# Altium schematic sheet NBT_FREQ_CNT.SCHDOC
size A4; Organization: Altium Limited; Address1: L3, 12a Rodborough Rd; Address2: Frenchs Forest; Address3: NSW; Address4: Australia 2086; DocumentNumber: 7; SheetNumber: 7; SheetTotal: 12
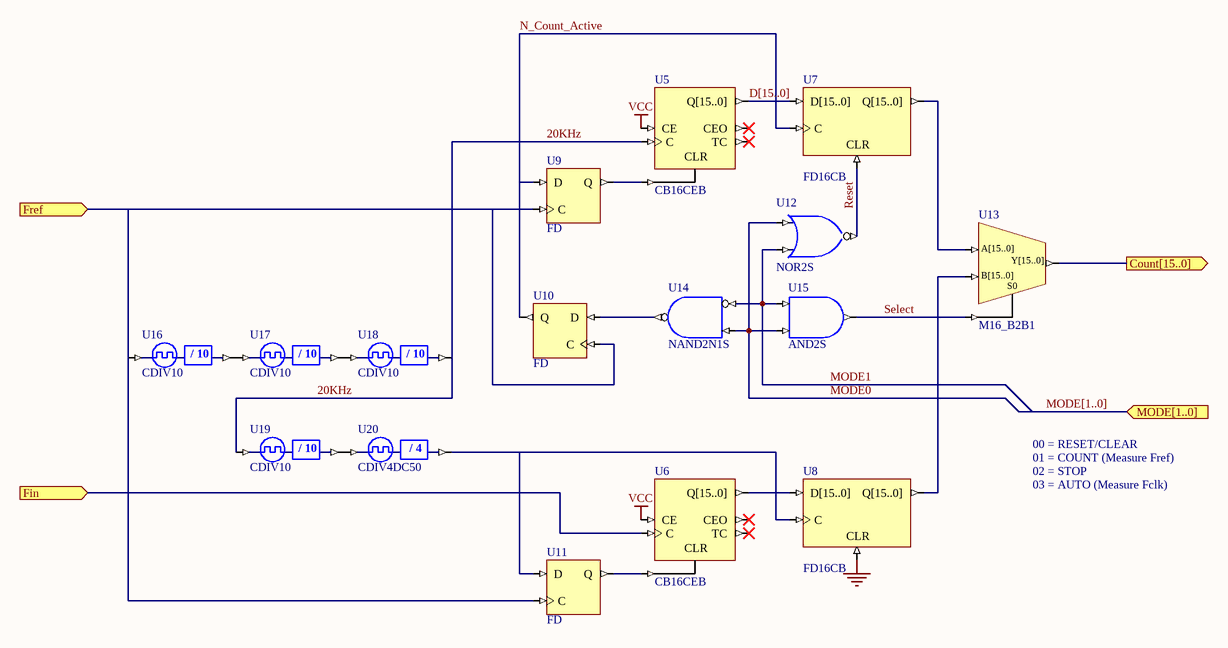
[diagram p0: NBT_FREQ_CNT.SCHDOC]

## Parts
U5  CB16CEB
U6  CB16CEB
U7  FD16CB
U8  FD16CB
U9  FD
U10  FD
U11  FD
U12  NOR2S
U13  M16_B2B1
U14  NAND2N1S
U15  AND2S
U16  CDIV10
U17  CDIV10
U18  CDIV10
U19  CDIV10
U20  CDIV4DC50

## Ports
Count[15..0] (out), Fin (in), Fref (in), MODE[1..0] (in)

## Nets
GND: U8.CLR
VCC: U5.CE U6.CE
20KHz: U5.C U18.CLKDV U19.CLKIN
Count[15..0]: U13.Y[15..0] ; port Count[15..0]
D[15..0]: U5.Q[15..0] U7.D[15..0]
Fin: U6.C ; port Fin
Fref: U9.C U10.C U11.C U16.CLKIN ; port Fref
MODE0: U12.I0 U14.I1 U15.I1
MODE1: U12.I1 U14.I0 U15.I0
N_Count_Active: U7.C U9.D U10.Q
Reset: U7.CLR U12.O
Select: U13.S0 U15.O
NetU5_CLR: U5.CLR U9.Q
NetU6_CLR: U6.CLR U11.Q
NetU6_Q[15..0]: U6.Q[15..0] U8.D[15..0]
NetU7_Q[15..0]: U7.Q[15..0] U13.A[15..0]
NetU8_C: U8.C U11.D U20.CLKDV
NetU8_Q[15..0]: U8.Q[15..0] U13.B[15..0]
NetU10_D: U10.D U14.O
NetU16_CLKDV: U16.CLKDV U17.CLKIN
NetU17_CLKDV: U17.CLKDV U18.CLKIN
NetU19_CLKDV: U19.CLKDV U20.CLKIN

Not connected (* = marked no-connect by the designer): U5 CEO* TC*; U6 CEO* TC*

## Buses and harness runs
bus D[15..0]
bus MODE[1..0] = port MODE[1..0]

## Notes on the sheet
- 00 = RESET/CLEAR
- 01 = COUNT (Measure Fref)
- 02 = STOP
- 03 = AUTO (Measure Fclk)
- Title
- Size:
- Date:
- A4
- Number:
- Time:
- Revision:
- Sheet
- of
- File:
- (in symbol CDIV4DC50) / 4
- (in symbol CDIV10) / 10

## Library data of the parts
U5 U6 = CB16CEB: 16-Bit Cascadable Binary Counters with Clock Enable and Asynchronous Clear, Bus Version; Xilinx Equivalent: CB16CE; ArchiveName: GENERIC; Published: 7-Nov-2003; Publisher: Altium Limited; Core Revision: 1.00.00
U7 U8 = FD16CB: 16-Bit D-Type Flip-Flop with Asynchronous Clear, Bus Version; ArchiveName: GENERIC; Published: 18-Dec-2003; Publisher: Altium Limited; Core Revision: 1.00.00
U9 U11 = FD: D-Type Flip-Flop; ArchiveName: GENERIC; Published: 18-Dec-2003; Publisher: Altium Limited; Xilinx Equivalent: FD; Core Revision: 1.00.00
U10 = FD: D-Type Flip-Flop; ArchiveName: GENERIC; VHDLIB_SIM: GENERIC_LIB; Published: 29-Jan-2004; Publisher: Altium Limited; Xilinx Equivalent: FD; Core Revision: 1.00.00
U12 = NOR2S: 2-Input NOR Gate, Single Pin Version; Xilinx Equivalent: NOR2; ArchiveName: GENERIC; VHDLIB_SIM: GENERIC_LIB; Published: 29-Jan-2004; Publisher: Altium Limited; Core Revision: 1.00.00
U13 = M16_B2B1: 2x16-Bit Bus to 1x16-Bit Bus Multiplexer; ArchiveName: GENERIC; VHDLIB_SIM: GENERIC_LIB; Published: 29-Jan-2004; Publisher: Altium Limited; Core Revision: 1.00.00
U14 = NAND2N1S: 2-Input NAND Gate with Active Low A Input, Single Pin Version; Xilinx Equivalent: NAND2B1; ArchiveName: GENERIC; VHDLIB_SIM: GENERIC_LIB; Published: 29-Jan-2004; Publisher: Altium Limited; Core Revision: 1.00.00
U15 = AND2S: 2-Input AND Gate, Single Pin Version; Xilinx Equivalent: AND2; ArchiveName: GENERIC; VHDLIB_SIM: GENERIC_LIB; Published: 29-Jan-2004; Publisher: Altium Limited; Core Revision: 1.00.00
U16-U19 = CDIV10: Clock Divider by 10; ArchiveName: GENERIC; Published: 7-Nov-2003; Publisher: Altium Limited; Core Revision: 1.00.00
U20 = CDIV4DC50: Clock Divider by 4 with 50% Duty Cycle Output; Xilinx Equivalent: CLK_DIV4; ArchiveName: GENERIC; Published: 7-Nov-2003; Publisher: Altium Limited; Core Revision: 1.00.00